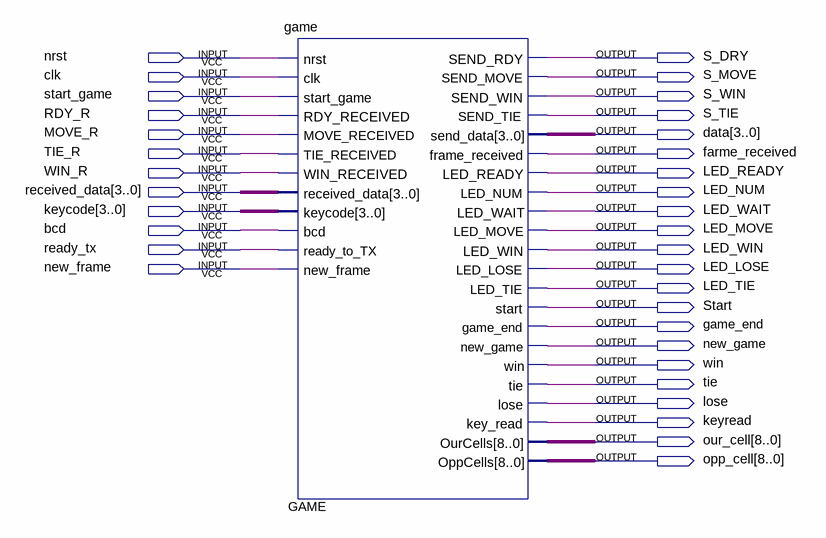
[diagram p0: schematic sheet]
// Quartus schematic game_sim.bdf as structural Verilog: 1 symbols, 34 pins
module game_sim (
  input  nrst,
  input  clk,
  input  start_game,
  input  RDY_R,
  input  MOVE_R,
  input  TIE_R,
  input  WIN_R,
  input  [3:0] received_data,
  input  [3:0] keycode,
  input  bcd,
  input  ready_tx,
  input  new_frame,
  output S_DRY,
  output S_MOVE,
  output S_WIN,
  output S_TIE,
  output [3:0] data,
  output farme_received,
  output LED_READY,
  output LED_NUM,
  output LED_WAIT,
  output LED_MOVE,
  output LED_WIN,
  output LED_LOSE,
  output LED_TIE,
  output Start,
  output game_end,
  output new_game,
  output win,
  output tie,
  output lose,
  output keyread,
  output [8:0] our_cell,
  output [8:0] opp_cell
);

  game GAME (
    .nrst(nrst), .clk(clk), .start_game(start_game), .RDY_RECEIVED(RDY_R), .MOVE_RECEIVED(MOVE_R),
    .TIE_RECEIVED(TIE_R), .WIN_RECEIVED(WIN_R), .received_data(received_data), .keycode(keycode), .bcd(bcd),
    .ready_to_TX(ready_tx), .new_frame(new_frame), .SEND_RDY(S_DRY), .SEND_MOVE(S_MOVE), .SEND_WIN(S_WIN),
    .SEND_TIE(S_TIE), .send_data(data), .frame_received(farme_received), .LED_READY(LED_READY),
    .LED_NUM(LED_NUM), .LED_WAIT(LED_WAIT), .LED_MOVE(LED_MOVE), .LED_WIN(LED_WIN), .LED_LOSE(LED_LOSE),
    .LED_TIE(LED_TIE), .start(Start), .game_end(game_end), .new_game(new_game), .win(win), .tie(tie),
    .lose(lose), .key_read(keyread), .OurCells(our_cell), .OppCells(opp_cell));
endmodule
